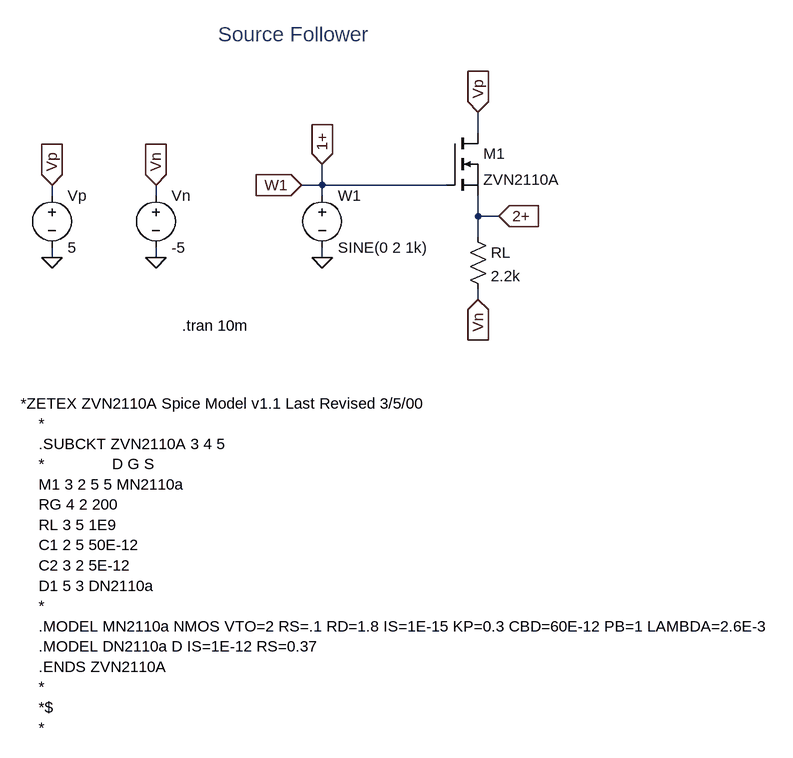
[diagram p0: schematic mos_src_flw.asc]
mos_src_flw.asc, the LTspice schematic file:
Version 4
SHEET 1 880 816
WIRE 208 32 208 0
WIRE -32 112 -32 80
WIRE -32 112 -64 112
WIRE 160 112 -32 112
WIRE -448 128 -448 112
WIRE -288 128 -288 112
WIRE -32 128 -32 112
WIRE 208 160 208 128
WIRE 240 160 208 160
WIRE 208 192 208 160
WIRE -448 224 -448 208
WIRE -288 224 -288 208
WIRE -32 224 -32 208
WIRE 208 288 208 272
FLAG 208 288 Vn
IOPIN 208 288 In
FLAG 208 0 Vp
IOPIN 208 0 In
FLAG -64 112 W1
IOPIN -64 112 In
FLAG -32 80 1+
IOPIN -32 80 In
FLAG 240 160 2+
IOPIN 240 160 In
FLAG -32 224 0
FLAG -448 224 0
FLAG -288 224 0
FLAG -448 112 Vp
IOPIN -448 112 In
FLAG -288 112 Vn
IOPIN -288 112 In
SYMBOL nmos 160 32 R0
SYMATTR InstName M1
SYMATTR Value ZVN2110A
SYMATTR Prefix X
SYMBOL res 192 176 R0
SYMATTR InstName RL
SYMATTR Value 2.2k
SYMBOL voltage -32 112 R0
WINDOW 123 0 0 Left 0
WINDOW 39 0 0 Left 0
SYMATTR InstName W1
SYMATTR Value SINE(0 2 1k)
SYMBOL voltage -448 112 R0
WINDOW 123 0 0 Left 0
WINDOW 39 0 0 Left 0
SYMATTR InstName Vp
SYMATTR Value 5
SYMBOL voltage -288 112 R0
WINDOW 123 0 0 Left 0
WINDOW 39 0 0 Left 0
SYMATTR InstName Vn
SYMATTR Value -5
TEXT -192 -120 Left 3 ;Source Follower
TEXT -496 448 Left 2 !*ZETEX ZVN2110A Spice Model v1.1 Last Revised 3/5/00\n    *\n    .SUBCKT ZVN2110A 3 4 5\n    *               D G S\n    M1 3 2 5 5 MN2110a\n    RG 4 2 200\n    RL 3 5 1E9\n    C1 2 5 50E-12\n    C2 3 2 5E-12\n    D1 5 3 DN2110a\n    *\n    .MODEL MN2110a NMOS VTO=2 RS=.1 RD=1.8 IS=1E-15 KP=0.3 CBD=60E-12 PB=1 LAMBDA=2.6E-3\n    .MODEL DN2110a D IS=1E-12 RS=0.37\n    .ENDS ZVN2110A\n    *\n    *$\n    *
TEXT -248 328 Left 2 !.tran 10m

The netlist it stands for:
* mos_src_flw.asc
XM1 Vp 1+ 2+ ZVN2110A  ; pins D G S
RL 2+ Vn 2.2k
V§W1 1+ 0 SINE(0 2 1k)
Vp Vp 0 5
Vn Vn 0 -5
* Source Follower
*ZETEX ZVN2110A Spice Model v1.1 Last Revised 3/5/00
    *
    .SUBCKT ZVN2110A 3 4 5
    *               D G S
    M1 3 2 5 5 MN2110a
    RG 4 2 200
    RL 3 5 1E9
    C1 2 5 50E-12
    C2 3 2 5E-12
    D1 5 3 DN2110a
    *
    .MODEL MN2110a NMOS VTO=2 RS=.1 RD=1.8 IS=1E-15 KP=0.3 CBD=60E-12 PB=1 LAMBDA=2.6E-3
    .MODEL DN2110a D IS=1E-12 RS=0.37
    .ENDS ZVN2110A
    *
    *$
    *
.tran 10m
.backanno
.end